# Altium schematic sheet MainController.SchDoc: =ProjectTitle
size B; Engineer: H. Collector; Organization: IMR Engineering; Address1: 3621 Gin Way; Address2: Snellville, GA 30039; Address3: USA; SheetNumber: 2; SheetTotal: 10
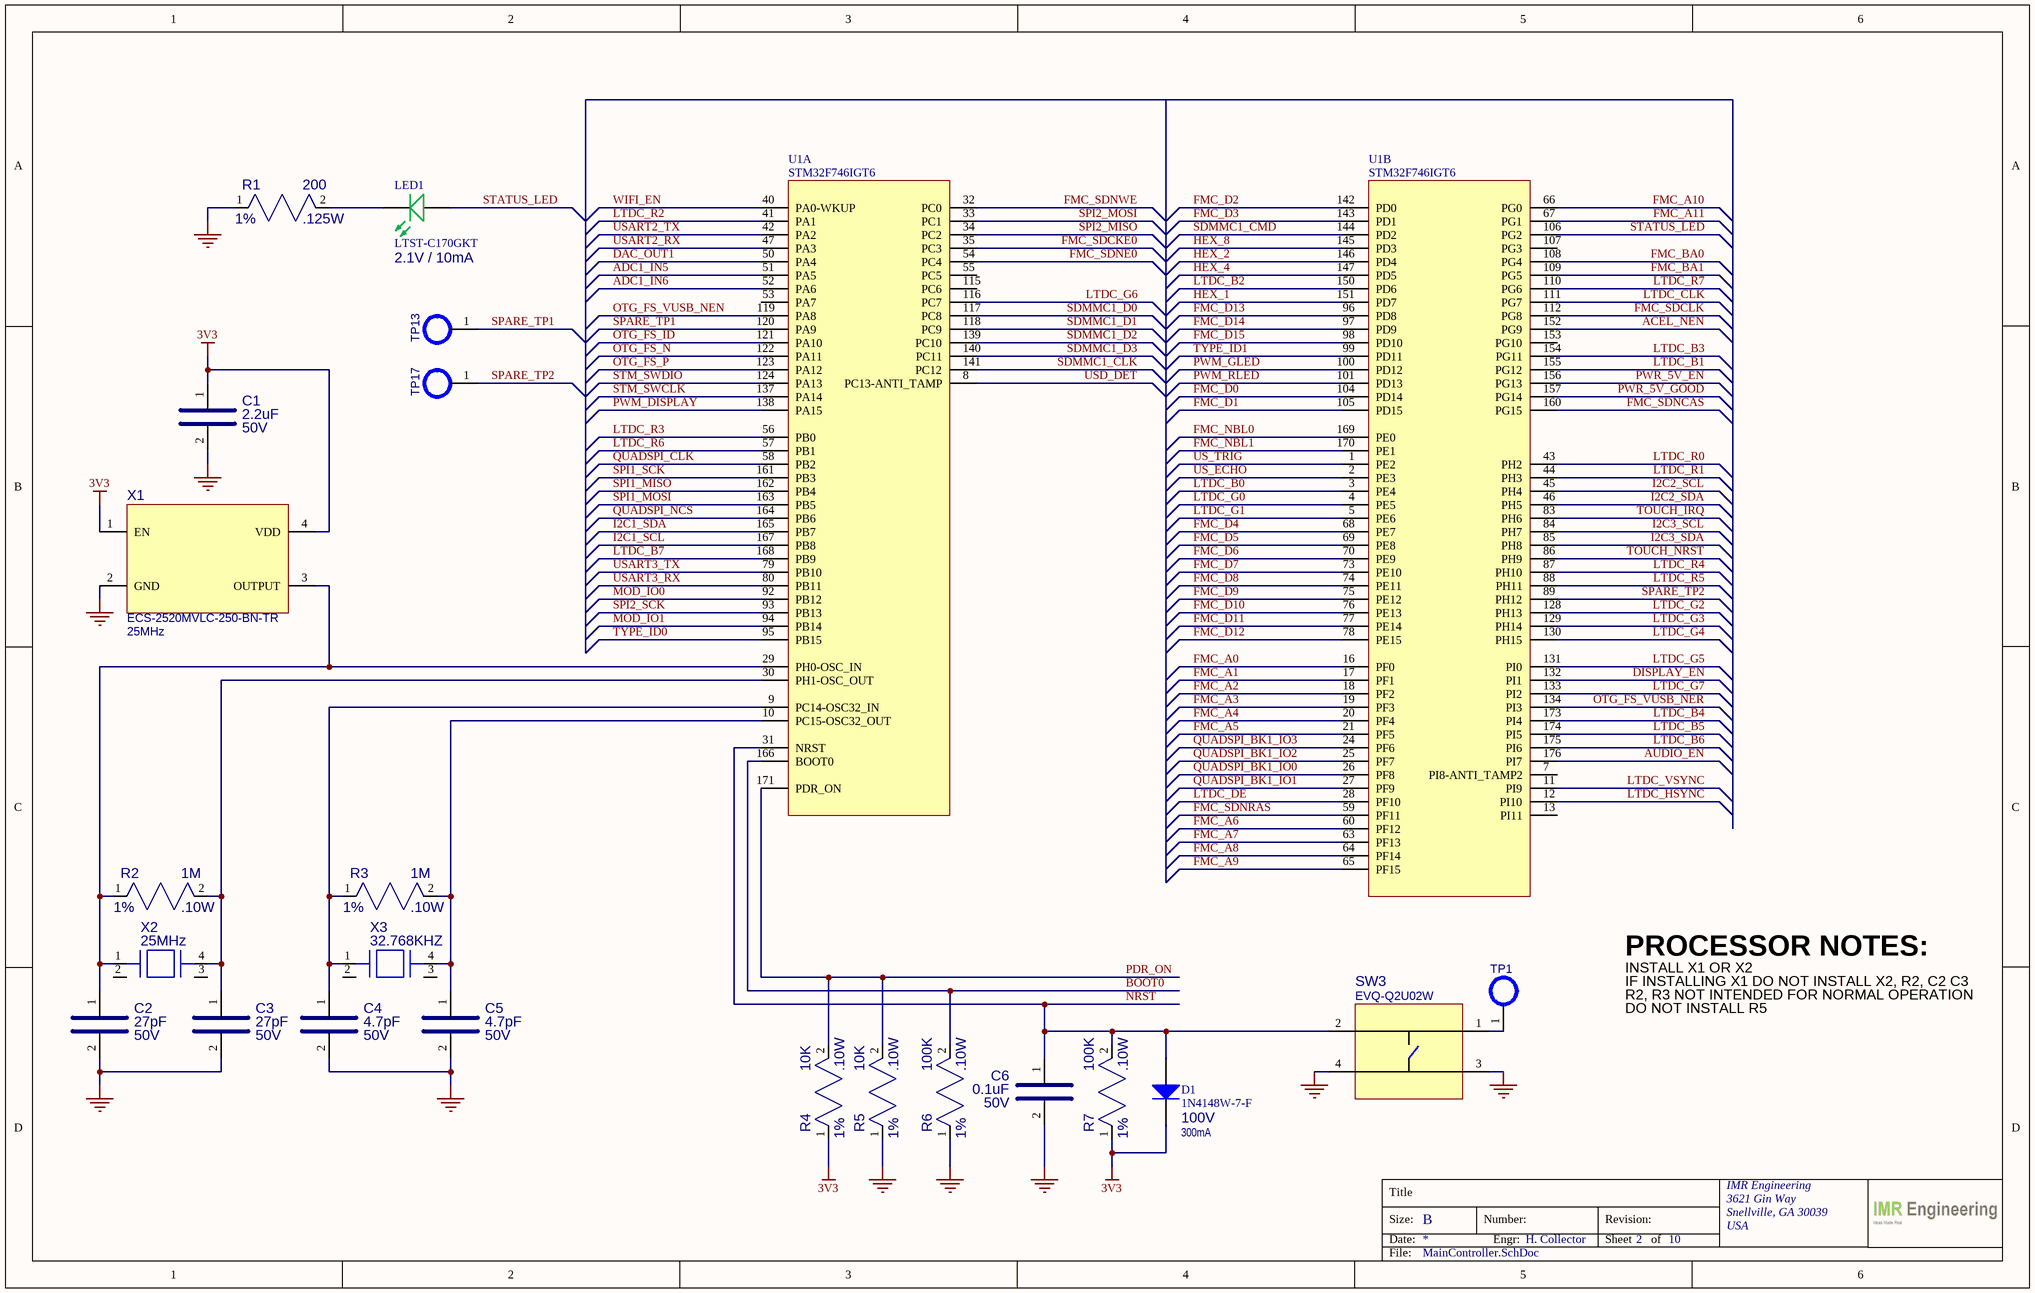
[diagram p0: MainController.SchDoc]

## Parts
C1  value 2.2uF  VOLTAGE: 50V  [CAP_0805]  (hidden comment: UMK212BB7225MG-T)
C2  value 27pF  VOLTAGE: 50V  [CAP_0603]  (hidden comment: CC0603KRNPO9BN270)
C3  value 27pF  VOLTAGE: 50V  [CAP_0603]  (hidden comment: CC0603KRNPO9BN270)
C4  value 4.7pF  VOLTAGE: 50V  [CAP_0603]  (hidden comment: CC0603CRNPO9BN4R7)
C5  value 4.7pF  VOLTAGE: 50V  [CAP_0603]  (hidden comment: CC0603CRNPO9BN4R7)
C6  value 0.1uF  VOLTAGE: 50V  [CAP_0603]  (hidden comment: CC0603KRX7R9BB104)
D1  value 100V  CURRENT: 300mA  [SOD123]  (hidden comment: 1N4148W-7-F)
LED1  value 2.1V / 10mA  [PMG_LTST-C170GKT]  (hidden comment: LTST-C170GKT)
R1  value 200  TOLERANCE: 1%  POWER: .125W  [RES_0805]  (hidden comment: RC0805FR-07200RL)
R2  value 1M  TOLERANCE: 1%  POWER: .10W  [RES_0603]  (hidden comment: RC0603FR-071ML)
R3  value 1M  TOLERANCE: 1%  POWER: .10W  [RES_0603]  (hidden comment: RC0603FR-071ML)
R4  value 10K  TOLERANCE: 1%  POWER: .10W  [RES_0603]  (hidden comment: RC0603FR-0710KL)
R5  value 10K  TOLERANCE: 1%  POWER: .10W  [RES_0603]  (hidden comment: RC0603FR-0710KL)
R6  value 100K  TOLERANCE: 1%  POWER: .10W  [RES_0603]  (hidden comment: RC0603FR-07100KL)
R7  value 100K  TOLERANCE: 1%  POWER: .10W  [RES_0603]  (hidden comment: RC0603FR-07100KL)
SW3  EVQ-Q2U02W  [SW_EVQ-Q2U02W]
TP1  TP_0635MM_HOLE  [TP_0635MM_HOLE]  (value not drawn)  (no BOM)
TP13  TP_0635MM_HOLE  [TP_0635MM_HOLE]  (value not drawn)  (no BOM)
TP17  TP_0635MM_HOLE  [TP_0635MM_HOLE]  (value not drawn)  (no BOM)
U1  STM32F746IGT6  [QFP50P2600X2600X160-176N]  (parts A,B of 3)
X1  value 25MHz  [OSC_ECS-2520S25-250-FN-TR]  (hidden comment: ECS-2520MVLC-250-BN-TR)
X2  value 25MHz  [XTAL_ECS]  (hidden comment: ECS-250-18-7SX-TR)
X3  value 32.768KHZ  [XTAL_ECS-.327-6-17X-TR]  (hidden comment: MC-306 32.7680K-E0:PURE SN)

## Nets
3V3: C1.1 D1.2(K) R4.1 R7.1 X1.1(EN) X1.4(VDD)
GND: C1.2 C2.2 C3.2 C4.2 C5.2 C6.2 R1.1 R5.1 R6.1 SW3.3(A) SW3.4(A') X1.2(GND)
ACEL_NEN: U1.152(PG9)
ADC1_IN5: U1.51(PA5)
ADC1_IN6: U1.52(PA6)
AUDIO_EN: U1.176(PI7)
BOOT0: R6.2 U1.166(BOOT0)
DAC_OUT1: U1.50(PA4)
DISPLAY_EN: U1.132(PI1)
FMC_A0: U1.16(PF0)
FMC_A1: U1.17(PF1)
FMC_A2: U1.18(PF2)
FMC_A3: U1.19(PF3)
FMC_A4: U1.20(PF4)
FMC_A5: U1.21(PF5)
FMC_A6: U1.60(PF12)
FMC_A7: U1.63(PF13)
FMC_A8: U1.64(PF14)
FMC_A9: U1.65(PF15)
FMC_A10: U1.66(PG0)
FMC_A11: U1.67(PG1)
FMC_BA0: U1.108(PG4)
FMC_BA1: U1.109(PG5)
FMC_D0: U1.104(PD14)
FMC_D1: U1.105(PD15)
FMC_D2: U1.142(PD0)
FMC_D3: U1.143(PD1)
FMC_D4: U1.68(PE7)
FMC_D5: U1.69(PE8)
FMC_D6: U1.70(PE9)
FMC_D7: U1.73(PE10)
FMC_D8: U1.74(PE11)
FMC_D9: U1.75(PE12)
FMC_D10: U1.76(PE13)
FMC_D11: U1.77(PE14)
FMC_D12: U1.78(PE15)
FMC_D13: U1.96(PD8)
FMC_D14: U1.97(PD9)
FMC_D15: U1.98(PD10)
FMC_NBL0: U1.169(PE0)
FMC_NBL1: U1.170(PE1)
FMC_SDCKE0: U1.35(PC3)
FMC_SDCLK: U1.112(PG8)
FMC_SDNCAS: U1.160(PG15)
FMC_SDNE0: U1.54(PC4)
FMC_SDNRAS: U1.59(PF11)
FMC_SDNWE: U1.32(PC0)
HEX_1: U1.151(PD7)
HEX_2: U1.146(PD4)
HEX_4: U1.147(PD5)
HEX_8: U1.145(PD3)
I2C1_SCL: U1.167(PB8)
I2C1_SDA: U1.165(PB7)
I2C2_SCL: U1.45(PH4)
I2C2_SDA: U1.46(PH5)
I2C3_SCL: U1.84(PH7)
I2C3_SDA: U1.85(PH8)
LTDC_B0: U1.3(PE4)
LTDC_B1: U1.155(PG12)
LTDC_B2: U1.150(PD6)
LTDC_B3: U1.154(PG11)
LTDC_B4: U1.173(PI4)
LTDC_B5: U1.174(PI5)
LTDC_B6: U1.175(PI6)
LTDC_B7: U1.168(PB9)
LTDC_CLK: U1.111(PG7)
LTDC_DE: U1.28(PF10)
LTDC_G0: U1.4(PE5)
LTDC_G1: U1.5(PE6)
LTDC_G2: U1.128(PH13)
LTDC_G3: U1.129(PH14)
LTDC_G4: U1.130(PH15)
LTDC_G5: U1.131(PI0)
LTDC_G6: U1.116(PC7)
LTDC_G7: U1.133(PI2)
LTDC_HSYNC: U1.12(PI10)
LTDC_R0: U1.43(PH2)
LTDC_R1: U1.44(PH3)
LTDC_R2: U1.41(PA1)
LTDC_R3: U1.56(PB0)
LTDC_R4: U1.87(PH10)
LTDC_R5: U1.88(PH11)
LTDC_R6: U1.57(PB1)
LTDC_R7: U1.110(PG6)
LTDC_VSYNC: U1.11(PI9)
MOD_IO0: U1.92(PB12)
MOD_IO1: U1.94(PB14)
NRST: C6.1 D1.1(A) R7.2 SW3.2(B') U1.31(NRST)
OTG_FS_ID: U1.121(PA10)
OTG_FS_N: U1.122(PA11)
OTG_FS_P: U1.123(PA12)
OTG_FS_VUSB_NEN: U1.119(PA8)
OTG_FS_VUSB_NER: U1.134(PI3)
PDR_ON: R4.2 R5.2 U1.171(PDR_ON)
PWM_DISPLAY: U1.138(PA15)
PWM_GLED: U1.100(PD12)
PWM_RLED: U1.101(PD13)
PWR_5V_EN: U1.156(PG13)
PWR_5V_GOOD: U1.157(PG14)
QUADSPI_BK1_IO0: U1.26(PF8)
QUADSPI_BK1_IO1: U1.27(PF9)
QUADSPI_BK1_IO2: U1.25(PF7)
QUADSPI_BK1_IO3: U1.24(PF6)
QUADSPI_CLK: U1.58(PB2)
QUADSPI_NCS: U1.164(PB6)
SDMMC1_CLK: U1.141(PC12)
SDMMC1_CMD: U1.144(PD2)
SDMMC1_D0: U1.117(PC8)
SDMMC1_D1: U1.118(PC9)
SDMMC1_D2: U1.139(PC10)
SDMMC1_D3: U1.140(PC11)
SPARE_TP1: TP13.1 U1.120(PA9)
SPARE_TP2: TP17.1 U1.89(PH12)
SPI1_MISO: U1.162(PB4)
SPI1_MOSI: U1.163(PB5)
SPI1_SCK: U1.161(PB3)
SPI2_MISO: U1.34(PC2)
SPI2_MOSI: U1.33(PC1)
SPI2_SCK: U1.93(PB13)
STATUS_LED: LED1.1(A) U1.106(PG2)
STM_SWCLK: U1.137(PA14)
STM_SWDIO: U1.124(PA13)
TOUCH_IRQ: U1.83(PH6)
TOUCH_NRST: U1.86(PH9)
TYPE_ID0: U1.95(PB15)
TYPE_ID1: U1.99(PD11)
US_ECHO: U1.2(PE3)
US_TRIG: U1.1(PE2)
USART2_RX: U1.47(PA3)
USART2_TX: U1.42(PA2)
USART3_RX: U1.80(PB11)
USART3_TX: U1.79(PB10)
USD_DET: U1.8(PC13-ANTI_TAMP)
WIFI_EN: U1.40(PA0-WKUP)
NetC2_1: C2.1 R2.1 U1.29(PH0-OSC_IN) X1.3(OUTPUT) X2.1
NetC3_1: C3.1 R2.2 U1.30(PH1-OSC_OUT) X2.4
NetC4_1: C4.1 R3.1 U1.9(PC14-OSC32_IN) X3.1
NetC5_1: C5.1 R3.2 U1.10(PC15-OSC32_OUT) X3.4
NetLED1_2: LED1.2(K) R1.2
NetSW3_1: SW3.1(B) TP1.1

Not connected (* = marked no-connect by the designer): U1 7(PI8-ANTI_TAMP2) 13(PI11) 53(PA7) 55(PC5) 107(PG3) 115(PC6) 153(PG10); X2 2 3; X3 2 3

## Notes on the sheet
- PROCESSOR NOTES:
- INSTALL X1 OR X2
- IF INSTALLING X1 DO NOT INSTALL X2, R2, C2 C3
- R2, R3 NOT INTENDED FOR NORMAL OPERATION
- DO NOT INSTALL R5
- Title
- Size:
- Date:
- B
- Number:
- Engr:
- Revision:
- Sheet
- of
- File:

## Library data of the parts
C1 = CAP_2.2UF_50V_0805: CAP CER 2.2UF 50V X7R 0805; MFG: Taiyo Yuden; TOLERANCE: 20%; MFG_PN: UMK212BB7225MG-T; Supplier 1: Digi-Key; Supplier Part Number 1: 587-4963-1-ND; Case/Package: 0805
C2 C3 = CAP_27PF_50V_0603: CAP CER 4.7PF 50V C0G/NPO 0603; MFG: Yageo; TOLERANCE: 10%; MFG_PN: CC0603KRNPO9BN270; Supplier 1: Digi-Key; Supplier Part Number 1: 311-4032-1-ND; Case/Package: 0603
C4 C5 = CAP_4.7PF_50V_0603: CAP CER 4.7PF 50V C0G/NPO 0603; MFG: Yageo; TOLERANCE: +/-.25pF; MFG_PN: CC0603CRNPO9BN4R7; Supplier 1: Digi-Key; Supplier Part Number 1: 311-1740-1-ND; Case/Package: 0603
C6 = CAP_0.1UF_50V_0603: CAP CER 0.1UF 50V X7R 0603; MFG: Yageo; TOLERANCE: 10%; MFG_PN: CC0603KRX7R9BB104; Supplier 1: Digi-Key; Supplier Part Number 1: 311-1344-1-ND; Case/Package: 0603
D1 = DIODE_1N4148W-7-F: DIODE GEN PURP 100V 300MA SOD123; MFG: Diodes Incorporated; Case/Package: SOD-123; Supplier 1: Digi-Key; Supplier Part Number 1: 1N4148W-FDICT-ND; MFG_PN: 1N4148W-7-F
LED1 = DIODE_LED_GREEN_LTST-C170GKT: DIODE, LED GREEN CLEAR SMD; MFG: Lite-On Inc.; Case/Package: 0805; Supplier 1: Digi-Key; Supplier Part Number 1: 160-1179-1-ND; MFG_PN: LTST-C170GKT
R1 = RES_200_0805_1/8W_1%_1: RES SMD 200 OHM 1% 1/8W 0805; MFG: Yageo; Case/Package: 0805; MFG_PN: RC0805FR-07200RL; Supplier 1: Digi-Key; Supplier Part Number 1: 311-200CRCT-ND
R2 R3 = RES_1M_0603_1/10W_1%: RES SMD 1M OHM 1% 1/10W 0603; MFG: Yageo; Case/Package: 0603; MFG_PN: RC0603FR-071ML; Supplier 1: Digi-Key; Supplier Part Number 1: 311-1.00MHRCT-ND
R4 R5 = RES_10K_0603_1/10W_1%: RES SMD 10K OHM 1% 1/10W 0603; MFG: Yageo; Case/Package: 0603; MFG_PN: RC0603FR-0710KL; Supplier 1: Digi-Key; Supplier Part Number 1: 311-10.0KHRCT-ND
R6 R7 = RES_100K_0603_1/10W_1%: RES SMD 100K OHM 1% 1/10W 0603; MFG: Yageo; Case/Package: 0603; MFG_PN: RC0603FR-07100KL; Supplier 1: Digi-Key; Supplier Part Number 1: 311-100KHRCT-ND
SW3 = SWITCH_EVQ-Q2U02W: SWITCH TACTILE SPST-NO 0.02A 15V; MFG: Panasonic Electronic Components; Case/Package: EVQ-Q2; Supplier 1: Digi-Key; Supplier Part Number 1: P12954SCT-ND; VALUE: 15V; MFG_PN: EVQ-Q2U02W
TP1 TP13 TP17 = TP_0635MM_HOLE: 3MM IN D. MT HOLE
U1 = IC_STM32F746NGH6U: STM32F746NGH6 (STM32F7 Birdie) TBGA216; MFG: STMicroelectronics; Value: 216MHz 1MB; Case/Package: 176LQFP; MFG_PN: STM32F746IGT6; Supplier 1: DigiKey; Supplier Part Number 1: 497-15817-ND
X1 = IC_OSC_ECS-2520MVLC-250-BN-TR: XTAL OSC XO 25MHZ CMOS SMD; MFG: ECS Inc.; MFG_PN: ECS-2520MVLC-250-BN-TR; Supplier 1: Digi-Key; Supplier Part Number 1: 50-ECS-2520MVLC-250-BN-CT-ND; Case/Package: 4-SMD
X2 = XTAL_25HZ_6PF_SMD: CRYSTAL 25.0000MHZ 18PF SMD; MFG: ECS Inc.; TOLERANCE: 30PPM; MFG_PN: ECS-250-18-7SX-TR; Supplier 1: Digi-Key; Supplier Part Number 1: XC2030-1-ND; Case/Package: XTAL_ECS
X3 = XTAL_32.768KHZ_6PF_SMD: CRYSTAL 32.7680KHZ 6PF SMD; MFG: EPSON; TOLERANCE: 100ppm; MFG_PN: MC-306 32.7680K-E0:PURE SN; Supplier 1: Digi-Key; Supplier Part Number 1: SER4097CT-ND; Case/Package: XTAL_ECS